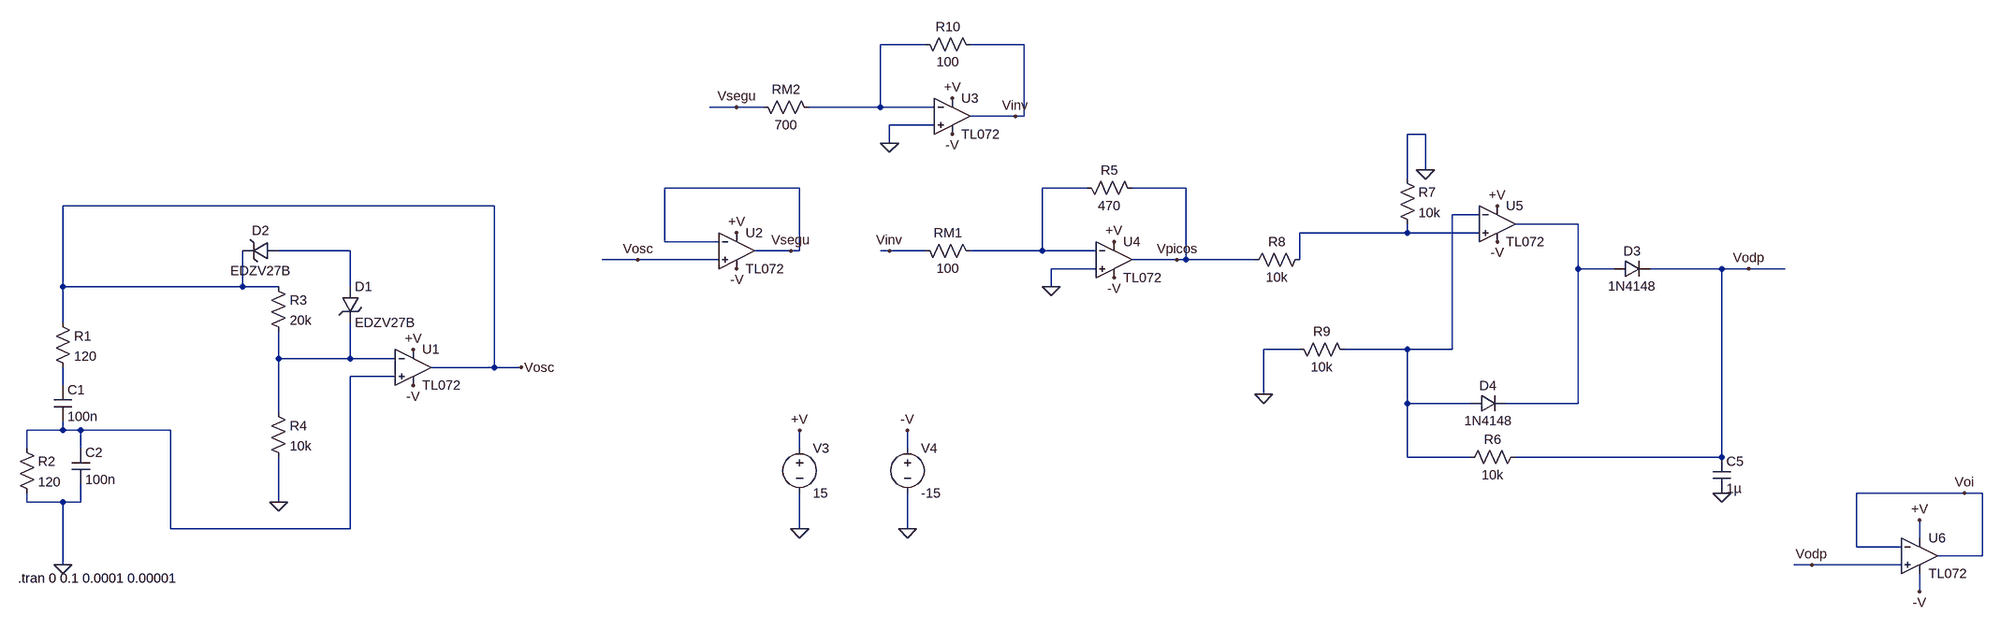
[diagram p0: schematic Circuito.asc]
Circuito.asc, the LTspice schematic file:
Version 4
SHEET 1 2804 1204
WIRE -1328 -912 -1408 -912
WIRE -1152 -912 -1248 -912
WIRE -1664 -800 -1712 -800
WIRE -1616 -800 -1664 -800
WIRE -1408 -800 -1408 -912
WIRE -1408 -800 -1536 -800
WIRE -1312 -800 -1408 -800
WIRE -1168 -784 -1248 -784
WIRE -1152 -784 -1152 -912
WIRE -1152 -784 -1168 -784
WIRE -1312 -768 -1392 -768
WIRE -416 -752 -448 -752
WIRE -1392 -736 -1392 -768
WIRE -416 -688 -416 -752
WIRE -448 -672 -448 -752
WIRE -1552 -656 -1792 -656
WIRE -1040 -656 -1120 -656
WIRE -864 -656 -960 -656
WIRE -2096 -624 -2864 -624
WIRE -320 -608 -368 -608
WIRE -144 -592 -256 -592
WIRE -448 -576 -448 -592
WIRE -448 -576 -640 -576
WIRE -320 -576 -448 -576
WIRE -1792 -560 -1792 -656
WIRE -1696 -560 -1792 -560
WIRE -2352 -544 -2480 -544
WIRE -1568 -544 -1632 -544
WIRE -1552 -544 -1552 -656
WIRE -1552 -544 -1568 -544
WIRE -1392 -544 -1408 -544
WIRE -1328 -544 -1392 -544
WIRE -1120 -544 -1120 -656
WIRE -1120 -544 -1248 -544
WIRE -1024 -544 -1120 -544
WIRE -1840 -528 -1904 -528
WIRE -1696 -528 -1840 -528
WIRE -880 -528 -960 -528
WIRE -864 -528 -864 -656
WIRE -864 -528 -880 -528
WIRE -720 -528 -864 -528
WIRE -640 -528 -640 -576
WIRE -1024 -512 -1104 -512
WIRE -144 -512 -144 -592
WIRE -80 -512 -144 -512
WIRE 112 -512 -16 -512
WIRE 160 -512 112 -512
WIRE 224 -512 160 -512
WIRE -2864 -480 -2864 -624
WIRE -2544 -480 -2544 -544
WIRE -2544 -480 -2864 -480
WIRE -2480 -480 -2544 -480
WIRE -2352 -480 -2352 -544
WIRE -1104 -480 -1104 -512
WIRE -2864 -416 -2864 -480
WIRE -640 -368 -704 -368
WIRE -448 -368 -560 -368
WIRE -368 -368 -368 -608
WIRE -368 -368 -448 -368
WIRE -2480 -352 -2480 -400
WIRE -2352 -352 -2352 -416
WIRE -2352 -352 -2480 -352
WIRE -2272 -352 -2352 -352
WIRE -2096 -336 -2096 -624
WIRE -2096 -336 -2208 -336
WIRE -2048 -336 -2096 -336
WIRE -2272 -320 -2352 -320
WIRE -2864 -304 -2864 -336
WIRE -704 -288 -704 -368
WIRE -448 -272 -448 -368
WIRE -336 -272 -448 -272
WIRE -144 -272 -144 -512
WIRE -144 -272 -272 -272
WIRE -2480 -256 -2480 -352
WIRE -2864 -224 -2864 -240
WIRE -2864 -224 -2928 -224
WIRE -2832 -224 -2864 -224
WIRE -2672 -224 -2832 -224
WIRE -2928 -192 -2928 -224
WIRE -2832 -192 -2832 -224
WIRE -1552 -192 -1552 -224
WIRE -1360 -192 -1360 -224
WIRE -448 -176 -448 -272
WIRE -336 -176 -448 -176
WIRE 112 -176 112 -512
WIRE 112 -176 -256 -176
WIRE 544 -112 352 -112
WIRE 576 -112 544 -112
WIRE -2928 -96 -2928 -112
WIRE -2864 -96 -2928 -96
WIRE -2832 -96 -2832 -128
WIRE -2832 -96 -2864 -96
WIRE -2480 -96 -2480 -176
WIRE -2672 -48 -2672 -224
WIRE -2352 -48 -2352 -320
WIRE -2352 -48 -2672 -48
WIRE -1552 -48 -1552 -112
WIRE -1360 -48 -1360 -112
WIRE 464 -32 464 -64
WIRE 352 -16 352 -112
WIRE 432 -16 352 -16
WIRE 576 0 576 -112
WIRE 576 0 496 0
WIRE -2864 16 -2864 -96
WIRE 272 16 240 16
WIRE 432 16 272 16
WIRE 464 64 464 32
FLAG -2864 16 0
FLAG -2480 -96 0
FLAG -1104 -480 0
FLAG -416 -688 0
FLAG -704 -288 0
FLAG 112 -112 0
FLAG -288 -560 -V
FLAG -288 -624 +V
FLAG -992 -496 -V
FLAG -992 -560 +V
FLAG -880 -528 Vpicos
FLAG -1552 -48 0
FLAG -1360 -48 0
FLAG -1360 -224 -V
FLAG -1552 -224 +V
FLAG -2240 -304 -V
FLAG -2240 -368 +V
FLAG -1664 -512 -V
FLAG -1664 -576 +V
FLAG -2048 -336 Vosc
FLAG -1840 -528 Vosc
FLAG -1392 -736 0
FLAG -1280 -752 -V
FLAG -1280 -816 +V
FLAG -1664 -800 Vsegu
FLAG -1568 -544 Vsegu
FLAG -1392 -544 Vinv
FLAG -1168 -784 Vinv
FLAG 272 16 Vodp
FLAG 160 -512 Vodp
FLAG 464 -64 +V
FLAG 464 64 -V
FLAG 544 -112 Voi
SYMBOL cap -2880 -304 R0
SYMATTR InstName C1
SYMATTR Value 100n
SYMBOL cap -2848 -192 R0
SYMATTR InstName C2
SYMATTR Value 100n
SYMBOL res -2880 -432 R0
SYMATTR InstName R1
SYMATTR Value 120
SYMBOL res -2944 -208 R0
SYMATTR InstName R2
SYMATTR Value 120
SYMBOL res -2496 -496 R0
SYMATTR InstName R3
SYMATTR Value 20k
SYMBOL res -2496 -272 R0
SYMATTR InstName R4
SYMATTR Value 10k
SYMBOL zener -2368 -480 R0
SYMATTR InstName D1
SYMATTR Value EDZV27B
SYMBOL zener -2480 -560 R90
WINDOW 0 -4 32 VBottom 2
WINDOW 3 36 32 VTop 2
SYMATTR InstName D2
SYMATTR Value EDZV27B
SYMBOL res -1056 -672 M90
WINDOW 0 0 56 VBottom 2
WINDOW 3 32 56 VTop 2
SYMATTR InstName R5
SYMATTR Value 470
SYMBOL res -1344 -560 M90
WINDOW 0 0 56 VBottom 2
WINDOW 3 32 56 VTop 2
SYMATTR InstName RM1
SYMATTR Value 100
SYMBOL diode -80 -528 M90
WINDOW 0 0 32 VBottom 2
WINDOW 3 32 32 VTop 2
SYMATTR InstName D3
SYMATTR Value 1N4148
SYMBOL diode -336 -288 M90
WINDOW 0 0 32 VBottom 2
WINDOW 3 32 32 VTop 2
SYMATTR InstName D4
SYMATTR Value 1N4148
SYMBOL res -240 -192 R90
WINDOW 0 0 56 VBottom 2
WINDOW 3 32 56 VTop 2
SYMATTR InstName R6
SYMATTR Value 10k
SYMBOL cap 96 -176 R0
SYMATTR InstName C5
SYMATTR Value 1µ
SYMBOL res -464 -688 R0
SYMATTR InstName R7
SYMATTR Value 10k
SYMBOL res -624 -544 R90
WINDOW 0 0 56 VBottom 2
WINDOW 3 32 56 VTop 2
SYMATTR InstName R8
SYMATTR Value 10k
SYMBOL res -656 -384 M90
WINDOW 0 0 56 VBottom 2
WINDOW 3 32 56 VTop 2
SYMATTR InstName R9
SYMATTR Value 10k
SYMBOL voltage -1552 -208 R0
WINDOW 123 0 0 Left 2
WINDOW 39 0 0 Left 2
SYMATTR InstName V3
SYMATTR Value 15
SYMBOL voltage -1360 -208 R0
WINDOW 123 0 0 Left 2
WINDOW 39 0 0 Left 2
SYMATTR InstName V4
SYMATTR Value -15
SYMBOL res -1344 -928 M90
WINDOW 0 0 56 VBottom 2
WINDOW 3 32 56 VTop 2
SYMATTR InstName R10
SYMATTR Value 100
SYMBOL res -1632 -816 M90
WINDOW 0 0 56 VBottom 2
WINDOW 3 32 56 VTop 2
SYMATTR InstName RM2
SYMATTR Value 700
SYMBOL Opamps\\TL072 -2240 -400 R0
SYMATTR InstName U1
SYMBOL Opamps\\TL072 -1664 -608 R0
SYMATTR InstName U2
SYMBOL Opamps\\TL072 -1280 -848 R0
SYMATTR InstName U3
SYMBOL Opamps\\TL072 -992 -592 R0
SYMATTR InstName U4
SYMBOL Opamps\\TL072 -288 -656 R0
SYMATTR InstName U5
SYMBOL Opamps\\TL072 464 -64 R0
SYMATTR InstName U6
TEXT -2944 40 Left 2 !.tran 0 0.1 0.0001 0.00001

The netlist it stands for:
* Circuito.asc
C1 N009 N008 100n
C2 N008 0 100n
R1 Vosc N009 120
R2 N008 0 120
R3 Vosc N007 20k
R4 N007 0 10k
D1 N006 N007 EDZV27B
D2 N006 Vosc EDZV27B
R5 N002 Vpicos 470
RM1 Vinv N002 100
D3 N004 Vodp 1N4148
D4 N003 N004 1N4148
R6 Vodp N003 10k
C5 Vodp 0 1µ
R7 0 N005 10k
R8 N005 Vpicos 10k
R9 0 N003 10k
V3 +V 0 15
V4 -V 0 -15
R10 N001 Vinv 100
RM2 Vsegu N001 700
XU1 N008 N007 +V -V Vosc TL072  ; pins In+ In- V+ V- OUT
XU2 Vosc Vsegu +V -V Vsegu TL072  ; pins In+ In- V+ V- OUT
XU3 0 N001 +V -V Vinv TL072  ; pins In+ In- V+ V- OUT
XU4 0 N002 +V -V Vpicos TL072  ; pins In+ In- V+ V- OUT
XU5 N005 N003 +V -V N004 TL072  ; pins In+ In- V+ V- OUT
XU6 Vodp Voi +V -V Voi TL072  ; pins In+ In- V+ V- OUT
.model D D
.lib standard.dio
.tran 0 0.1 0.0001 0.00001
.backanno
.end